# EAGLE design accelerometer (EAGLE 5.10)
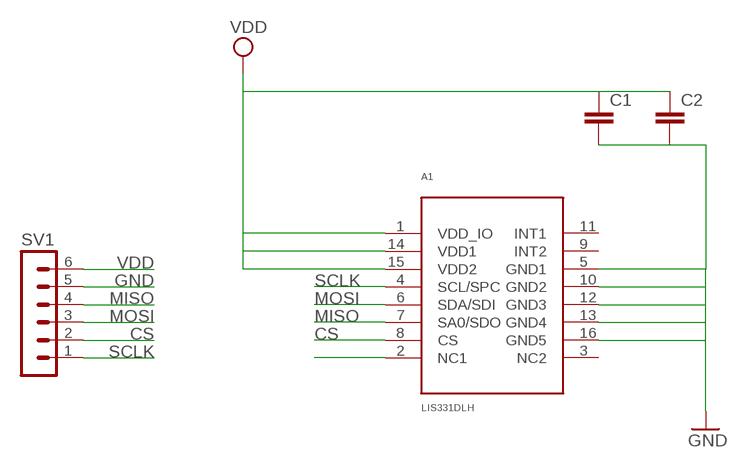
[diagram p0: schematic, sheet 1]

## Parts
A1  LIS331DLH  [LGA16-3X3]
C1  C-EUC1206  [C1206]
C2  C-EUC1206  [C1206]
SV1  MA06-1  [MA06-1]

## Nets
CS: A1.8(CS) SV1.2
GND: A1.5(GND1) A1.10(GND2) A1.12(GND3) A1.13(GND4) A1.16(GND5) C1.2 C2.2 SV1.5
MISO: A1.7(SA0/SDO) SV1.4
MOSI: A1.6(SDA/SDI) SV1.3
N$6: A1.2(NC1)
SCLK: A1.4(SCL/SPC) SV1.1
VDD: A1.1(VDD_IO) A1.14(VDD1) A1.15(VDD2) C1.1 C2.1 SV1.6
Unconnected: A1.3(NC2) A1.9(INT2) A1.11(INT1)

## Library data of the parts
A1 = LIS331DLH:LIS331DLH
C1 C2 = rcl:C-EU: CAPACITOR, European symbol
SV1 = con-lstb:MA06-1: PIN HEADER

## Board
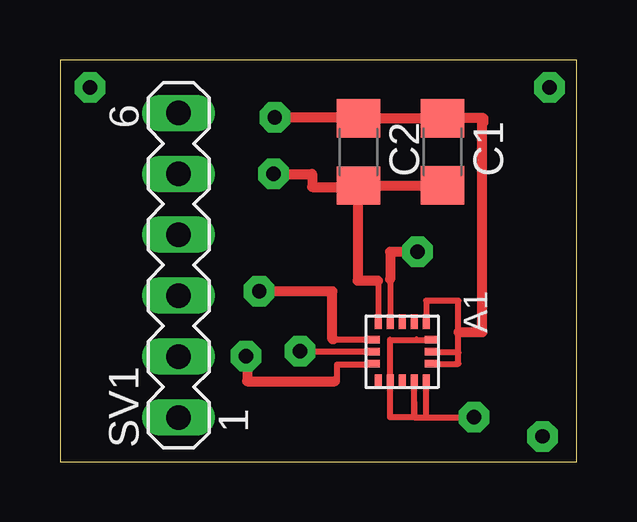
[diagram p1: board, top side]
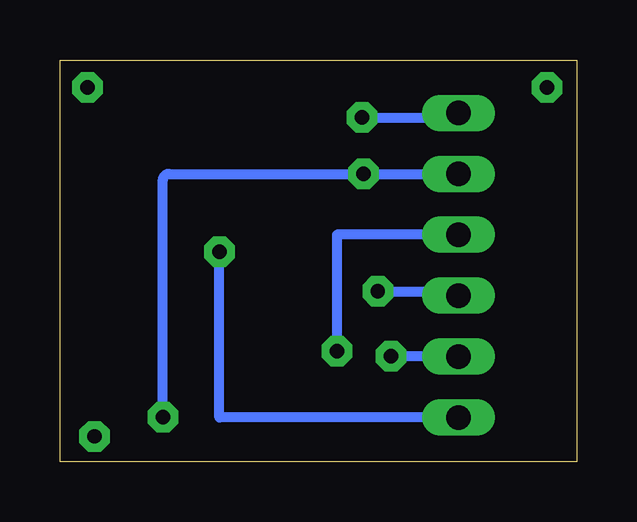
[diagram p2: board, bottom side, seen from below]

Size 21.54 x 16.75 mm. Coordinates in mm from the lower left corner, seen from the top.
Outline: 0,0 21.54,0 21.54,16.75 0,16.75 0,0
Copper layers (1*16): Top 0.035mm / dielectric 1.5mm / Bottom 0.035mm
Design rules "default": minimum track width 20mil, minimum drill 32mil, track to track 16mil, track to pad 16mil, pad to pad 16mil, via to via 16mil, smd to smd 12mil, copper to edge 40mil, drill to drill 40mil, minimum pad ring 10mil, minimum via ring 8mil, stop-mask expansion 4mil, vias tented up to drill 0mil, thermal gap 10mil

### Footprints (pad centres in the part's own frame; a part is rotated, then mirrored left to right if it is on the bottom)
LGA16-3X3 = smd 0.61 x 0.305: 1 -1.25,1; 2 -1.25,0.5; 3 -1.25,0; 4 -1.25,-0.5; 5 -1.25,-1; 9 1.25,-1; 10 1.25,-0.5; 11 1.25,0; 12 1.25,0.5; 13 1.25,1 | smd 0.305 x 0.61: 6 -0.5,-1.25; 7 0,-1.25; 8 0.5,-1.25; 14 0.5,1.25; 15 0,1.25; 16 -0.5,1.25
C1206 = smd 1.6 x 1.8: 1 -1.4,0; 2 1.4,0
MA06-1 = drill 1.016 long: 1 -6.35,0; 2 -3.81,0; 3 -1.27,0; 4 1.27,0; 5 3.81,0; 6 6.35,0

### Placement (x,y rotation side)
A1  14.26,4.58 270 top
C1  15.94,12.92 270 top
C2  12.44,12.91 270 top
SV1  4.94,8.19 90 top

### Tracks (layer width: path | path; a pad name or v marks a point on that pad's centre or on a via)
CS  (via drill 0.6 pad 1.27)
  Top 0.254: 11.45,3.35 11.55,3.35 11.55,4.05 13.01,4.05 A1.8
  Top 0.406: v7.75,4.4 7.8,4.4 7.8,3.35 11.45,3.35
  Bottom 0.406: SV1.2 7.75,4.38 v7.75,4.4
GND  (via drill 0.6 pad 1.27)
  Top 0.254: A1.10 13.76,4.95 13.75,4.95 | A1.10 13.75,1.85 14.75,1.85 14.75,2.5 | 14.75,2.5 14.76,1.85 | 14.76,1.85 A1.12 14.75,2.5 | 14.76,1.85 15.26,1.85 | 15.26,1.85 A1.13 | A1.16 13.75,5.08 13.75,4.95 | A1.5 13.25,7.55 | A1.10 13.75,4.95 | 15.26,1.85 v17.25,1.85
  Top 0.406: v8.9,12 10.5,12 10.5,11.45 12.44,11.45 C2.2 | C1.2 C2.2 | C2.2 12.4,11.51 12.4,7.55 13.25,7.55
  Bottom 0.406: SV1.5 v8.9,12 17,12 arc-90 17.25,11.75 v17.25,1.85
MISO  (via drill 0.6 pad 1.27)
  Top 0.254: v10,4.6 13.01,4.6 A1.7
  Bottom 0.406: SV1.4 10,9.46 v10,4.6
MOSI  (via drill 0.6 pad 1.27)
  Top 0.254: A1.6 11.4,5.08 11.4,5.1
  Top 0.406: 11.4,5.1 11.35,5.1 11.35,7.1 v8.3,7.1
  Bottom 0.406: v8.3,7.1 4.94,7.1 SV1.3
N$1  (via drill 0.6 pad 1.27)
  other vias: 1.25,15.6
N$2  (via drill 0.6 pad 1.27)
  other vias: 20.4,15.6
N$3  (via drill 0.6 pad 1.27)
  other vias: 20.1,1.05
SCLK  (via drill 0.6 pad 1.27)
  Top 0.254: 13.75,7.6 arc90 13.76,7.51 A1.4
  Top 0.406: v14.9,8.75 13.75,8.75 13.75,7.6
  Bottom 0.406: SV1.1 14.9,1.84 v14.9,8.75
VDD  (via drill 0.6 pad 1.27)
  Top 0.254: A1.14 16.6,4.08 16.6,4.55 | 16.6,4.55 15.51,4.55 A1.15 | A1.1 15.25,6.7 16.6,6.7 16.6,5.4 16.6,4.55
  Top 0.406: 16.6,5.4 17.6,5.4 17.6,14.15 17.65,14.15 17.65,14.32 C1.1 C2.1 12.44,14.54 12.35,14.35 v8.95,14.35
  Bottom 0.406: v8.95,14.35 4.99,14.35 SV1.6